# Altium schematic sheet Sheet1.SchDoc
size A3; SheetNumber: 1; SheetTotal: 2
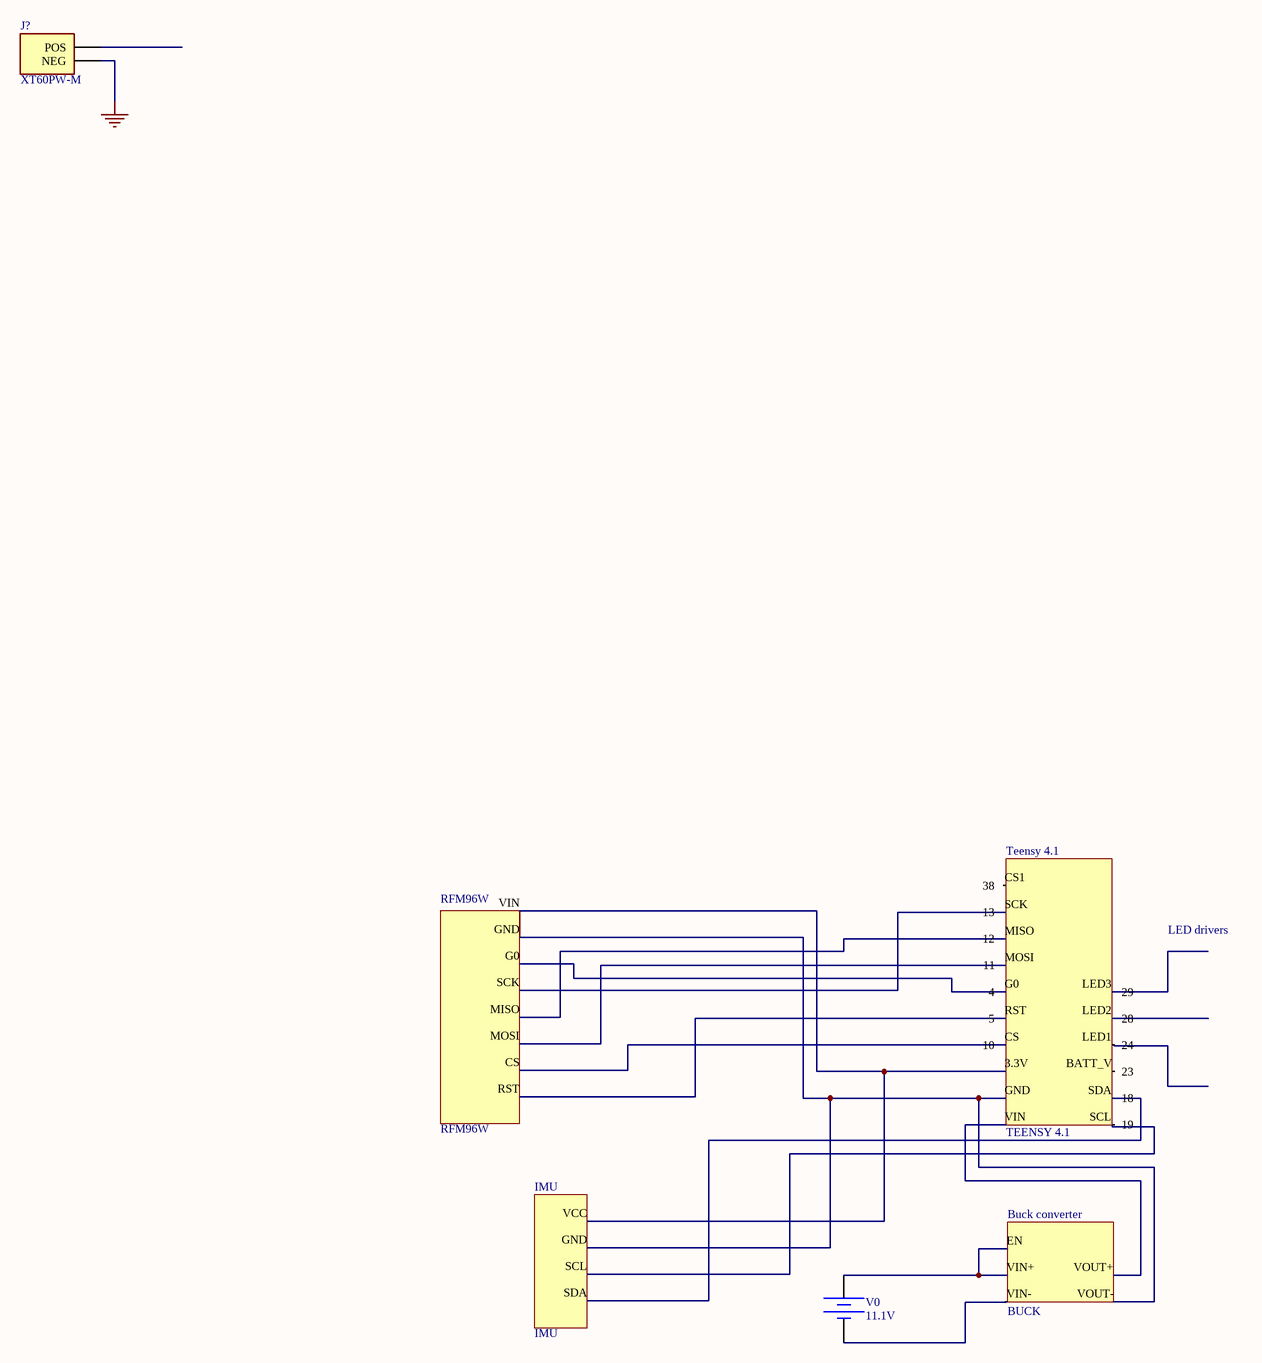
[diagram p0: Sheet1.SchDoc]

## Parts
?  TEENSY 4.1
Buck_converter  BUCK
IMU  IMU
J?  XT60PW-M
RFM96W  RFM96W
V0  DC Magnitude: 11.1V  (hidden comment: Constant Voltage Source)

## Nets
GND: J?.2(NEG)
Net?_3.3V: ?.3.3V IMU.VCC RFM96W.VIN
Net?_CS: ?.CS(10) RFM96W.CS
Net?_G0: ?.G0(4) RFM96W.G0
Net?_GND: ?.GND Buck_converter.VOUT- IMU.GND RFM96W.GND
Net?_MISO: ?.MISO(12) RFM96W.MISO
Net?_MOSI: ?.MOSI(11) RFM96W.MOSI
Net?_RST: ?.RST(5) RFM96W.RST
Net?_SCK: ?.SCK(13) RFM96W.SCK
Net?_SCL: ?.SCL(19) IMU.SCL
Net?_SDA: ?.SDA(18) IMU.SDA
Net?_VIN: ?.VIN Buck_converter.VOUT+
NetBuck_converter_EN: Buck_converter.EN Buck_converter.VIN+ V0.1

Not connected (* = marked no-connect by the designer): ? BATT_V(23) CS1(38) LED1(24) LED2(28) LED3(29); Buck_converter VIN-; J? 1(POS); V0 2

## Notes on the sheet
- LED drivers
- (in symbol TEENSY 4.1) Teensy 4.1

## Library data of the parts
? = TEENSY 4.1: iMXRT1062 Microcontroller Development Board 600MHz CPU 1GB RAM 8MB Flash; Manufacturer: SparkFun; Manufacturer Part Number: DEV-16771; Supplier: Mouser; Supplier Part Number: 474-DEV-16771; RoHS: No; Category: Embedded Processors and Controllers; Stock: 742; Pricing: 1=38.75, 10=38.75, 50=38.75, 100=38.75, 1000=38.75, 10000=38.75 (USD); ComponentLink1URL: https://media.digikey.com/pdf/Data%20Sheets/Sparkfun%20PDFs/DEV-16771_Web.pdf?src-supplier=Digikey; ComponentLink1Description: https://media.digikey.com/pdf/Data%20Sheets/Sparkfun%20PDFs/DEV-16771_Web.pdf?src-supplier=Digikey
J? = XT60PW-M: XT60PW-M Through Hole Lithium-Ion Model Connectors RoHS; Parameter 1: *
RFM96W = RFM96W: Banana Plug; Female to Multi-Stacking Banana Plug; Nickel Plated Brass; Manufacturer: Adafruit Industries; Manufacturer Part Number: 3073; Supplier: Rs; Supplier Part Number: 1245502; RoHS: No; Category: RF Semiconductors and Devices; Stock: 69; Pricing: 1=21.74, 5=19.15, 10=16.88, 100=19.36 (EUR); ComponentLink1URL: https://learn.adafruit.com/downloads/pdf/adafruit-rfm69hcw-and-rfm96-rfm95-rfm98-lora-packet-padio-breakouts.pdf?src-supplier=Digikey; ComponentLink1Description: https://learn.adafruit.com/downloads/pdf/adafruit-rfm69hcw-and-rfm96-rfm95-rfm98-lora-packet-padio-breakouts.pdf?src-supplier=Digikey
V0 = Battery: SimulationGenericComponent: True